# Altium schematic sheet LCD_screen.SchDoc: LCD illeszteszése
size A4; Author: Király Krisztina; Organization: BME-AUT; DocumentNumber: 1; Revision: 17; SheetNumber: 1; SheetTotal: 4
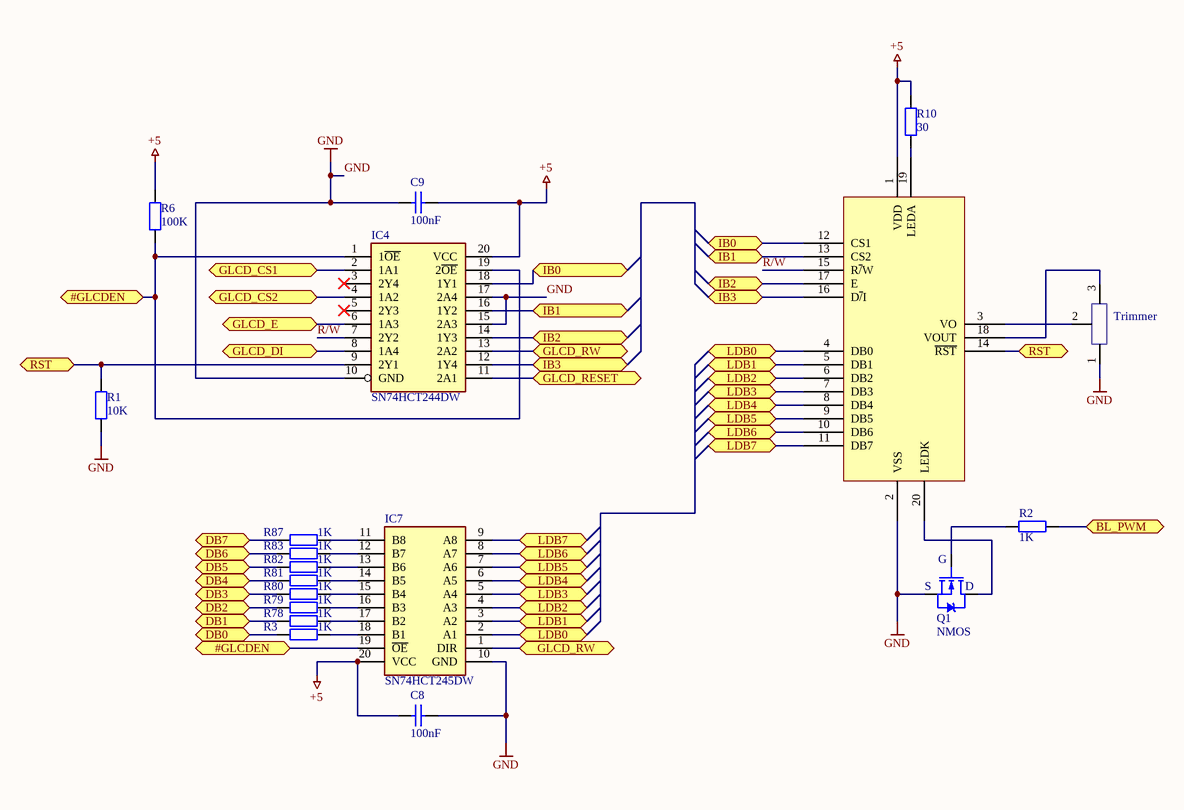
[diagram p0: LCD_screen.SchDoc]

## Parts
BC817  LCD Screen  [FP_LCD]  (value not drawn)
C8  100nF  [FP_0805_CAP_085]
C9  100nF  [FP_0805_CAP_085]
IC4  SN74HCT244DW  [SOIC127P1030X265-20N]
IC7  SN74HCT245DW  [SOIC127P1030X265-20N]
Q1  NMOS  [FP_SOT23-3]
R1  10K  [FP_0805_RES]
R2  1K  [FP_0805_RES]
R3  1K  [FP_0805_RES]
R6  100K  [FP_0805_RES]
R10  30  [FP_0805_RES]
R78  1K  [FP_0805_RES]
R79  1K  [FP_0805_RES]
R80  1K  [FP_0805_RES]
R81  1K  [FP_0805_RES]
R82  1K  [FP_0805_RES]
R83  1K  [FP_0805_RES]
R87  1K  [FP_0805_RES]
Trimmer  (no value)  [TRIM_3362P-1-502]

## Ports
#GLCDEN (bidir), BL_PWM (bidir), DB0 (bidir), DB1 (bidir), DB2 (bidir), DB3 (bidir), DB4 (bidir), DB5 (bidir), DB6 (bidir), DB7 (bidir), GLCD_CS1 (bidir), GLCD_CS2 (bidir), GLCD_DI (bidir), GLCD_E (bidir), GLCD_RESET (bidir), GLCD_RW (bidir), IB0 (bidir), IB1 (bidir), IB2 (bidir), IB3 (bidir), LDB0 (bidir), LDB1 (bidir), LDB2 (bidir), LDB3 (bidir), LDB4 (bidir), LDB5 (bidir), LDB6 (bidir), LDB7 (bidir), RST (bidir)

## Nets
+5: BC817.1(VDD) C8.1 C9.2 IC4.20(VCC) IC7.20(VCC) R6.2 R10.2
GND: BC817.2(VSS) C8.2 C9.1 IC4.10(GND) IC4.15(2A3) IC4.17(2A4) IC7.10(GND) Q1.3(S) R1.1 Trimmer.1
#GLCDEN: IC4.1(1~{OE}) IC4.19(2~{OE}) IC7.19(~{OE}) R6.1 ; port #GLCDEN
BL_PWM: R2.2 ; port BL_PWM
DB0: R3.1 ; port DB0
DB1: R78.1 ; port DB1
DB2: R79.1 ; port DB2
DB3: R80.1 ; port DB3
DB4: R81.1 ; port DB4
DB5: R82.1 ; port DB5
DB6: R83.1 ; port DB6
DB7: R87.1 ; port DB7
GLCD_CS1: IC4.2(1A1) ; port GLCD_CS1
GLCD_CS2: IC4.4(1A2) ; port GLCD_CS2
GLCD_DI: IC4.8(1A4) ; port GLCD_DI
GLCD_E: IC4.6(1A3) ; port GLCD_E
GLCD_RESET: IC4.11(2A1) ; port GLCD_RESET
GLCD_RW: IC4.13(2A2) IC7.1(DIR) ; port GLCD_RW
IB0: BC817.12(CS1) IC4.18(1Y1) ; port IB0
IB1: BC817.13(CS2) IC4.16(1Y2) ; port IB1
IB2: BC817.17(E) IC4.14(1Y3) ; port IB2
IB3: BC817.16(D~{/}I) IC4.12(1Y4) ; port IB3
LDB0: BC817.4(DB0) IC7.2(A1) ; port LDB0
LDB1: BC817.5(DB1) IC7.3(A2) ; port LDB1
LDB2: BC817.6(DB2) IC7.4(A3) ; port LDB2
LDB3: BC817.7(DB3) IC7.5(A4) ; port LDB3
LDB4: BC817.8(DB4) IC7.6(A5) ; port LDB4
LDB5: BC817.9(DB5) IC7.7(A6) ; port LDB5
LDB6: BC817.10(DB6) IC7.8(A7) ; port LDB6
LDB7: BC817.11(DB7) IC7.9(A8) ; port LDB7
R/W: BC817.15(R~{/}W) IC4.7(2Y2)
RST: BC817.14(~{RST}) IC4.9(2Y1) R1.2 ; port RST
NetBC817_3: BC817.3(VO) Trimmer.2
NetBC817_18: BC817.18(VOUT) Trimmer.3
NetBC817_19: BC817.19(LEDA) R10.1
NetBC817_20: BC817.20(LEDK) Q1.2(D)
NetIC7_11: IC7.11(B8) R87.2
NetIC7_12: IC7.12(B7) R83.2
NetIC7_13: IC7.13(B6) R82.2
NetIC7_14: IC7.14(B5) R81.2
NetIC7_15: IC7.15(B4) R80.2
NetIC7_16: IC7.16(B3) R79.2
NetIC7_17: IC7.17(B2) R78.2
NetIC7_18: IC7.18(B1) R3.2
NetQ1_1: Q1.1(G) R2.1

Not connected (* = marked no-connect by the designer): IC4 3(2Y4)* 5(2Y3)*

## Notes on the sheet
- (near Q1) S
- (near Q1) G
- (near Q1) D
- Title
- Size:
- Date:
- A4
- Number:
- Time:
- Revision:
- Sheet
- of
- File:

## Library data of the parts
BC817 = LCD Screen: Reference: TME; Name: RG12864A-BIW-V; Supplier: Tanszék
C8 C9 = CAP: Capacitor; Name: 100nF 0805 10% 50V X7R 0805B104K500NT (FNG); Supplier: Lomex; Reference: 82-13-46; Value: 100nF
IC4 = SN74HCT244DW: Integrated Circuit; Manufacturer_Name: Texas Instruments; Name: TEXAS INSTRUMENTS SN74HCT244DWR; Reference: 3006172; Datasheet Link: http://www.ti.com/lit/ds/symlink/sn74hct244.pdf; Height: 2.65mm; Manufacturer_Part_Number: SN74HCT244DW; Mouser Part Number: 595-SN74HCT244DW; Mouser Price/Stock: https://www.mouser.co.uk/ProductDetail/Texas-Instruments/SN74HCT244DW?qs=8yeEWhuAOtPaf02S2l6zdA%3D%3D; Arrow Part Number: SN74HCT244DW; Arrow Price/Stock: https://www.arrow.com/en/products/sn74hct244dw/texas-instruments?region=nac; Supplier: Farnell
IC7 = SN74HCT245DW: Integrated Circuit; Manufacturer_Name: Texas Instruments; Name: 74HCT245D (NXP) 8xBIDIRECTIONAL BUS TRANSCEIVER 3-STATE OUTPUT SO-20 WIDE; Datasheet Link: http://www.ti.com/lit/ds/symlink/sn74hct245.pdf; Height: 2.65mm; Manufacturer_Part_Number: SN74HCT245DW; Mouser Part Number: 595-SN74HCT245DW; Mouser Price/Stock: https://www.mouser.co.uk/ProductDetail/Texas-Instruments/SN74HCT245DW?qs=5h8QSfodyRguwsnqzMvAgw%3D%3D; Arrow Part Number: SN74HCT245DW; Arrow Price/Stock: https://www.arrow.com/en/products/sn74hct245dw/texas-instruments?region=nac; Supplier: Lomex; Reference: 87-06-35
Q1 = NMOS: NXP - BSP030,115 - MOSFET, N CH, 30V, 10A, SOT223; pin to pad: 2>3 3>2; Name: 2N7002 (NXP) N-FET 60V 0.3A 0.83W Rds<5R SOT-23 ˝12W˝ (SN7002); Supplier: Lomex; Reference: 86-00-97
R1 = RES: Resistor; Name: 10K0 0805 5% RS-05K103JT 0.125W (FNG); Supplier: Lomex; Reference: 81-35-05; Value: 10K
R2 R3 R78-R83 R87 = RES: Resistor; Name: 1K00 0805 5% CR-05JL7----1K 0.125W (VIK); Supplier: Lomex; Reference: 81-10-87; Value: 1K
R6 = RES: Resistor; Name: 100K 0805 5% CR-05JL7--100K 0.125W (VIK); Supplier: Lomex; Reference: 81-11-11; Value: 100K
R10 = RES: Resistor; Name: 30R0 0805 5% WR08X300JTL 0.125W (WAL); Supplier: Lomex; Reference: 81-29-89; Value: 30
Trimmer = Trimmer: Name: 5K00 3362P-502R (KIC) 6.6x7mm 1#-1# CERMET FEKVÖ; Supplier: Lomex; Reference: 05-06-68; Max value: *; Min value: *